# Altium schematic sheet SingleDriver.SchDoc
size A4
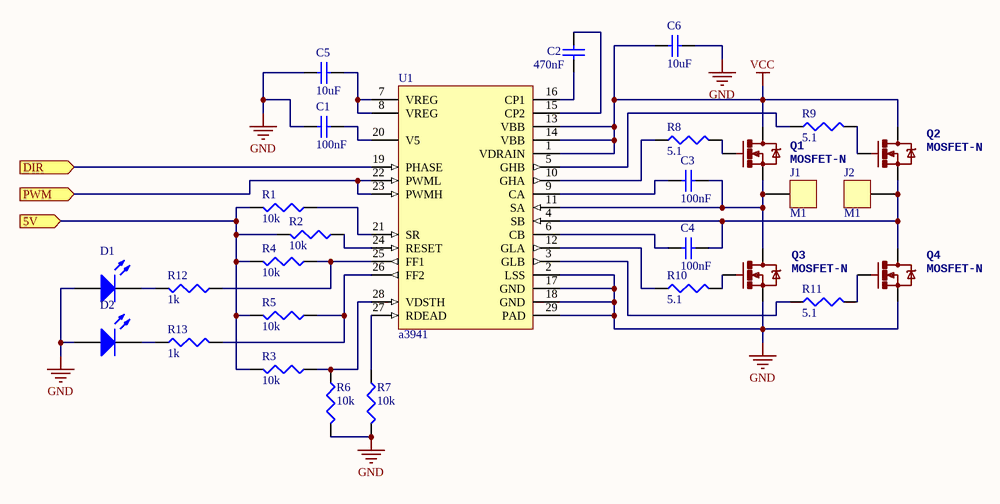
[diagram p0: SingleDriver.SchDoc]

## Parts
C1  100nF  [1608[0603]]
C2  470nF  [1608[0603]]
C3  100nF  [1608[0603]]
C4  100nF  [1608[0603]]
C5  10uF  [C1206]
C6  10uF  [C1206]
D1  LED2  [1608[0603]]  (value not drawn)
D2  LED2  [1608[0603]]  (value not drawn)
J1  M1  [POWER-VIA]
J2  M1  [POWER-VIA]
Q1  MOSFET-N  [SOT669]
Q2  MOSFET-N  [SOT669]
Q3  MOSFET-N  [SOT669]
Q4  MOSFET-N  [SOT669]
R1  10k  [J1-0603]
R2  10k  [J1-0603]
R3  10k  [J1-0603]
R4  10k  [J1-0603]
R5  10k  [J1-0603]
R6  10k  [J1-0603]
R7  10k  [J1-0603]
R8  5.1  [J1-0603]
R9  5.1  [J1-0603]
R10  5.1  [J1-0603]
R11  5.1  [J1-0603]
R12  1k  [J1-0603]
R13  1k  [J1-0603]
U1  a3941  [TSSOP28]

## Ports
5V (in), DIR (in), PWM (in)

## Nets
GND: C1.1 C5.1 C6.2 D1.1(A) D2.1(A) Q3.S Q4.S R6.2 R7.2 U1.2(LSS) U1.17(GND) U1.18(GND) U1.29(PAD)
VCC: C6.1 Q1.D Q2.D U1.1(VDRAIN) U1.13(VBB) U1.14(VBB)
5V: R1.2 R2.2 R3.2 R4.2 R5.2 ; port 5V
DIR: U1.19(PHASE) ; port DIR
PWM: U1.22(PWML) U1.23(PWMH) ; port PWM
NetC1_2: C1.2 U1.20(V5)
NetC2_1: C2.1 U1.16(CP1)
NetC2_2: C2.2 U1.15(CP2)
NetC3_1: C3.1 U1.9(CA)
NetC3_2: C3.2 J1.1 Q1.S Q3.D U1.11(SA)
NetC4_1: C4.1 U1.6(CB)
NetC4_2: C4.2 J2.1 Q2.S Q4.D U1.4(SB)
NetC5_2: C5.2 U1.7(VREG) U1.8(VREG)
NetD1_2: D1.2(K) R12.2
NetD2_2: D2.2(K) R13.1
NetQ1_G: Q1.G R8.2
NetQ2_G: Q2.G R9.2
NetQ3_G: Q3.G R10.2
NetQ4_G: Q4.G R11.2
NetR1_1: R1.1 U1.21(SR)
NetR2_1: R2.1 U1.24(RESET)
NetR3_1: R3.1 R6.1 U1.28(VDSTH)
NetR4_1: R4.1 R12.1 U1.25(FF1)
NetR5_1: R5.1 R13.2 U1.26(FF2)
NetR7_1: R7.1 U1.27(RDEAD)
NetR8_1: R8.1 U1.10(GHA)
NetR9_1: R9.1 U1.5(GHB)
NetR10_1: R10.1 U1.12(GLA)
NetR11_1: R11.1 U1.3(GLB)

## Library data of the parts
C1-C6 = Cap Semi: Capacitor (Semiconductor SIM Model); Value: 100pF; Published: 8-Jun-2000; LatestRevisionDate: 29-May-2009; LatestRevisionNote: IPC-7351 Footprint Added.; PackageReference: C1206; Publisher: Altium Limited; PackageDescription: Chip Capacitor
D1 D2 = LED2: Typical RED, GREEN, YELLOW, AMBER GaAs LED; Published: 8-Jun-2000; LatestRevisionDate: 17-Jul-2002; LatestRevisionNote: Re-released for DXP Platform.; PackageVersion: Feb-2002; PackageReference: 3.2X1.6X1.1; Publisher: Altium Limited; PackageDescription: SM LED; 2 Flat Leads
J1 J2 = HEADER-1
Q1-Q4 = MOSFET-N: PROD_ID: IC-08089
R1-R11 = Res3: Resistor; Value: 1K; Published: 8-Jun-2000; LatestRevisionDate: 29-May-2009; LatestRevisionNote: IPC-7351 Footprint Added.; PackageReference: J1-0603; Publisher: Altium Limited; PackageDescription: Chip Resistor
R12 R13 = Res3: Resistor; Published: 8-Jun-2000; LatestRevisionDate: 29-May-2009; LatestRevisionNote: IPC-7351 Footprint Added.; PackageReference: J1-0603; Publisher: Altium Limited; PackageDescription: Chip Resistor; Value: 1K